# EAGLE schematic logger_lambda-bak (EAGLE 6.6.0)
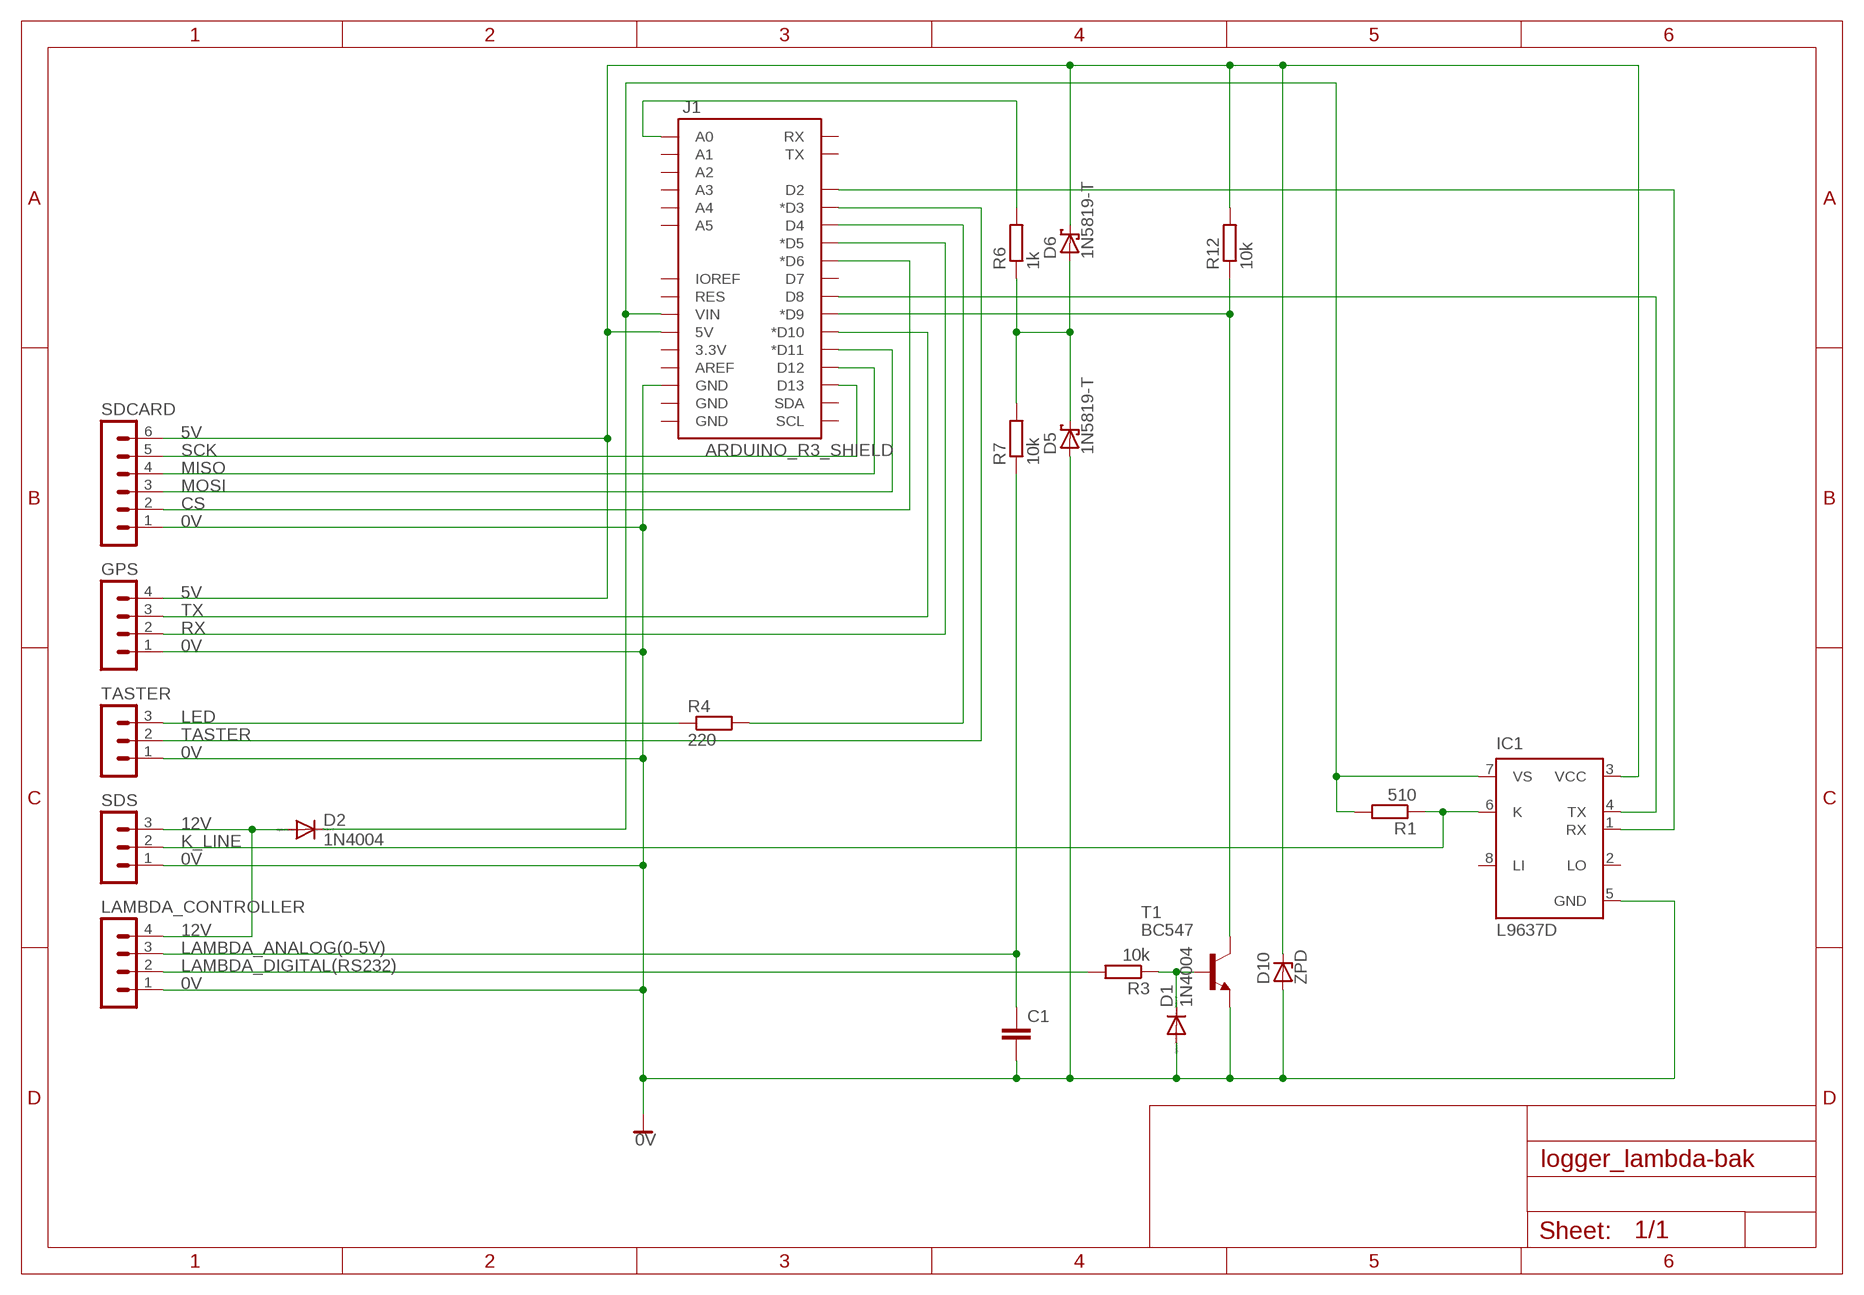
[diagram p0: schematic, sheet 1]

## Parts
C1  C2,5-3  [C2.5-3]
D1  1N4004  [DO41-10]
D2  1N4004  [DO41-10]
D5  1N5819-T  [DO41-7.6]
D6  1N5819-T  [DO41-7.6]
D10  ZPD  [DO35Z10]
GPS  MA04-1  [MA04-1]
IC1  L9637D  [SO08]
J1  ARDUINO_R3_SHIELD  [UNO_R3_SHIELD]
LAMBDA_CONTROLLER  MA04-1  [MA04-1]
R1  510  R-EU_0207/7  [0207/7]
R3  10k  R-EU_0207/7  [0207/7]
R4  220  R-EU_0207/7  [0207/7]
R6  1k  R-EU_0207/7  [0207/7]
R7  10k  R-EU_0207/7  [0207/7]
R12  10k  R-EU_0207/7  [0207/7]
SDCARD  MA06-1  [MA06-1]
SDS  MA03-1  [MA03-1]
T1  BC547  [TO92]
TASTER  MA03-1  [MA03-1]

## Nets
0V: C1.2 D1.A D5.A D10.A GPS.1 IC1.5(GND) J1.GND@2(GND) LAMBDA_CONTROLLER.1 SDCARD.1 SDS.1 T1.1(E) TASTER.1
5V: D6.C D10.C GPS.4 IC1.3(VCC) J1.5V R12.2 SDCARD.6
12V: D2.A LAMBDA_CONTROLLER.4 SDS.3
ANALOG_IN: D5.C D6.A J1.A0 R6.1 R6.2 R7.2
CS: J1.D6(*D6) SDCARD.2
DIGITAL_OUT: J1.D4
K_LINE: IC1.6(K) R1.1 SDS.2
LAMBDA_ANALOG(0-5V): C1.1 LAMBDA_CONTROLLER.3 R7.1
LAMBDA_DIGITAL(RS232): LAMBDA_CONTROLLER.2 R3.2
LED: R4.1 R4.2 TASTER.3
MISO: J1.D12 SDCARD.4
MOSI: J1.D11(*D11) SDCARD.3
N$1: D1.C R3.1 T1.2(B)
RX: GPS.2 J1.D5(*D5)
RX0: IC1.4(TX) J1.D8
RX1: J1.D9(*D9) R12.1 T1.3(C)
SCK: J1.D13 SDCARD.5
TASTER: J1.D3(*D3) TASTER.2
TX: GPS.3 J1.D10(*D10)
TX0: IC1.1(RX) J1.D2
VIN: D2.C IC1.7(VS) J1.VIN R1.2
Unconnected: IC1.2(LO) IC1.8(LI) J1.3.3V J1.A1 J1.A2 J1.A3 J1.A4 J1.A5 J1.AREF J1.D7 J1.GND@0(GND) J1.GND@1(GND) J1.IOREF J1.RES J1.RX J1.SCL J1.SDA J1.TX

## Library data of the parts
C1 = capacitor-wima:C: CAPACITOR naming: grid - package width
D1 D2 = diode:1N4004: DIODE general purpose rectifier, 1 A
D5 D6 = diode:1N581*: 1.0A SCHOTTKY BARRIER RECTIFIER Source: http://www.diodes.com/datasheets/ds23001.pdf
D10 = diode:ZPD: Z DIODE 500 mW
GPS LAMBDA_CONTROLLER = con-lstb:MA04-1: PIN HEADER; OC_FARNELL: unknown; OC_NEWARK: unknown
IC1 = st-microelectronics:L9637D: ISO 9141 INTERFACE Source: 1765.pdf; MPN: L9637D; OC_FARNELL: unknown; OC_NEWARK: 56P8926
J1 = SparkFun-Boards:ARDUINO_R3_SHIELD: Shield form compatible with the Arduino Uno R3.
R1 R3 R4 R6 R7 R12 = rcl:R-EU_: RESISTOR, European symbol
SDCARD = con-lstb:MA06-1: PIN HEADER; OC_FARNELL: unknown; OC_NEWARK: unknown
SDS TASTER = con-lstb:MA03-1: PIN HEADER; OC_FARNELL: unknown; OC_NEWARK: unknown
T1 = transistor:BC547: NPN TRANSISTOR